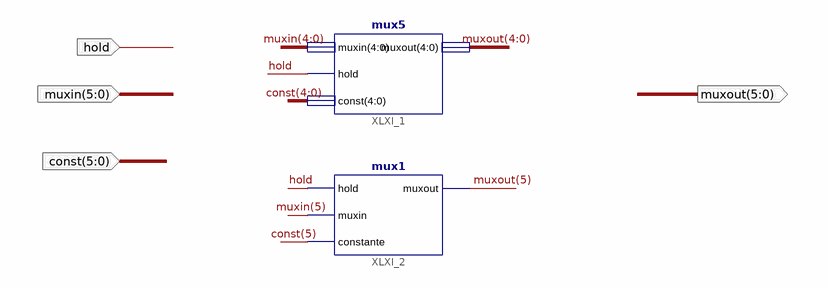
[diagram p0: schematic sheet 1]
// Xilinx ISE schematic mux6.sch (artix7) as structural Verilog: 2 symbols, 4 ports
module mux6 (
  input  hold,
  input  [5:0] muxin,
  input  [5:0] \const ,
  output [5:0] muxout
);

  mux5 XLXI_1 (.muxin(muxin[4:0]), .hold(hold), .\const (\const [4:0]), .muxout(muxout[4:0]));
  mux1 XLXI_2 (.hold(hold), .muxin(muxin[5]), .constante(\const [5]), .muxout(muxout[5]));
endmodule
